# EAGLE design LED3 (EAGLE 9.6.0)
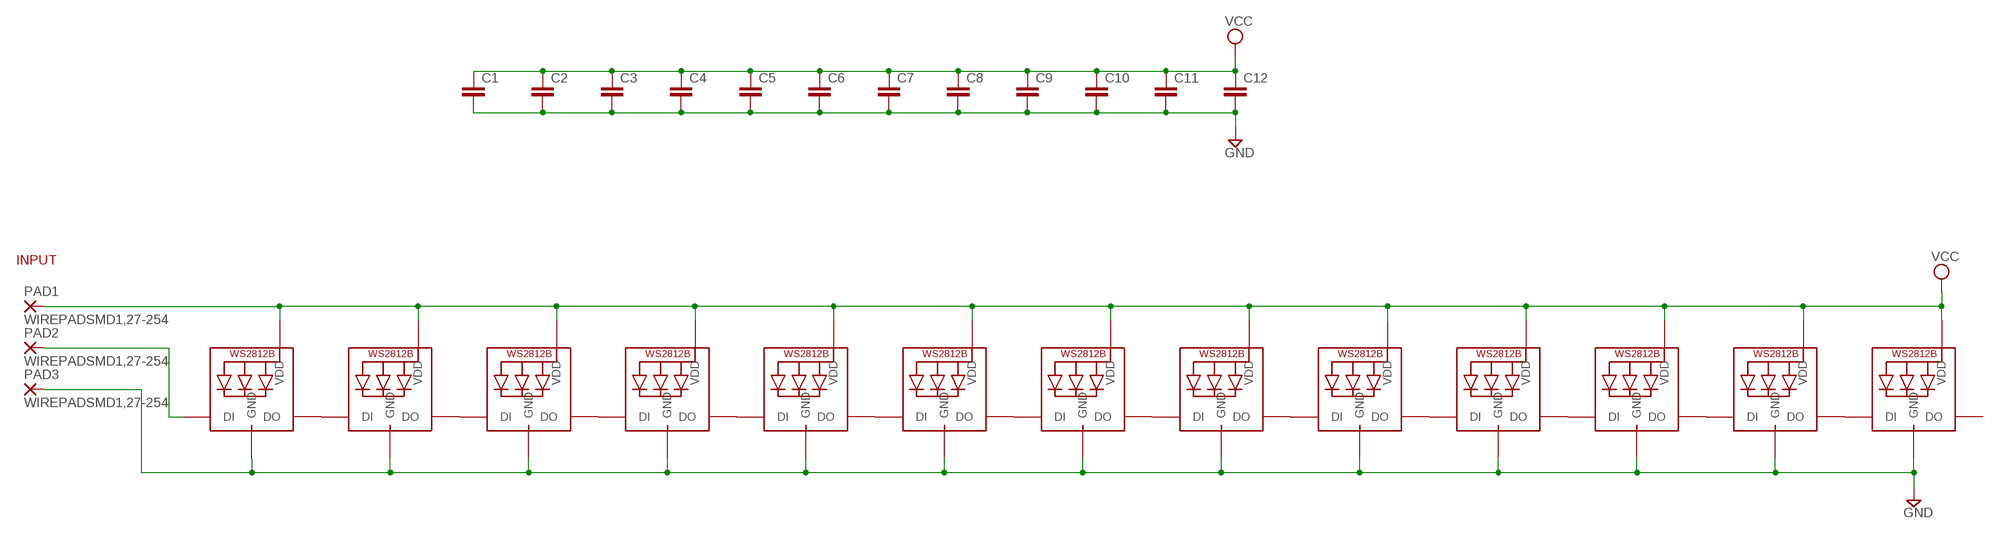
[diagram p0: schematic, sheet 1]

## Parts
C1  C-EUC0805K  [C0805K]
C2  C-EUC0805K  [C0805K]
C3  C-EUC0805K  [C0805K]
C4  C-EUC0805K  [C0805K]
C5  C-EUC0805K  [C0805K]
C6  C-EUC0805K  [C0805K]
C7  C-EUC0805K  [C0805K]
C8  C-EUC0805K  [C0805K]
C9  C-EUC0805K  [C0805K]
C10  C-EUC0805K  [C0805K]
C11  C-EUC0805K  [C0805K]
C12  C-EUC0805K  [C0805K]
LED1  WS2812B5050  [WS2812B]
LED2  WS2812B5050  [WS2812B]
LED3  WS2812B5050  [WS2812B]
LED4  WS2812B5050  [WS2812B]
LED5  WS2812B5050  [WS2812B]
LED6  WS2812B5050  [WS2812B]
LED7  WS2812B5050  [WS2812B]
LED8  WS2812B5050  [WS2812B]
LED9  WS2812B5050  [WS2812B]
LED10  WS2812B5050  [WS2812B]
LED11  WS2812B5050  [WS2812B]
LED12  WS2812B5050  [WS2812B]
LED13  WS2812B5050  [WS2812B]
PAD1  WIREPADSMD1,27-254  [SMD1,27-2,54]
PAD2  WIREPADSMD1,27-254  [SMD1,27-2,54]
PAD3  WIREPADSMD1,27-254  [SMD1,27-2,54]

## Nets
GND: C1.2 C2.2 C3.2 C4.2 C5.2 C6.2 C7.2 C8.2 C9.2 C10.2 C11.2 C12.2 LED1.3-GND(GND) LED2.3-GND(GND) LED3.3-GND(GND) LED4.3-GND(GND) LED5.3-GND(GND) LED6.3-GND(GND) LED7.3-GND(GND) LED8.3-GND(GND) LED9.3-GND(GND) LED10.3-GND(GND) LED11.3-GND(GND) LED12.3-GND(GND) LED13.3-GND(GND) PAD3.1(P)
N$1: LED1.2-DOUT(DO) LED2.4-DIN(DI)
N$2: LED2.2-DOUT(DO) LED3.4-DIN(DI)
N$3: LED3.2-DOUT(DO) LED4.4-DIN(DI)
N$4: LED4.2-DOUT(DO) LED5.4-DIN(DI)
N$5: LED5.2-DOUT(DO) LED6.4-DIN(DI)
N$6: LED6.2-DOUT(DO) LED7.4-DIN(DI)
N$7: LED8.2-DOUT(DO) LED9.4-DIN(DI)
N$8: LED9.2-DOUT(DO) LED10.4-DIN(DI)
N$9: LED10.2-DOUT(DO) LED11.4-DIN(DI)
N$10: LED11.2-DOUT(DO) LED12.4-DIN(DI)
N$11: LED12.2-DOUT(DO) LED13.4-DIN(DI)
N$12: LED7.2-DOUT(DO) LED8.4-DIN(DI)
N$14: LED1.4-DIN(DI) PAD2.1(P)
VCC: C1.1 C2.1 C3.1 C4.1 C5.1 C6.1 C7.1 C8.1 C9.1 C10.1 C11.1 C12.1 LED1.1-VDD(VDD) LED2.1-VDD(VDD) LED3.1-VDD(VDD) LED4.1-VDD(VDD) LED5.1-VDD(VDD) LED6.1-VDD(VDD) LED7.1-VDD(VDD) LED8.1-VDD(VDD) LED9.1-VDD(VDD) LED10.1-VDD(VDD) LED11.1-VDD(VDD) LED12.1-VDD(VDD) LED13.1-VDD(VDD) PAD1.1(P)
Unconnected: LED13.2-DOUT(DO)

## Notes on the sheet
- INPUT

## Library data of the parts
C1-C12 = rcl:C-EU: CAPACITOR, European symbol; SPICEPREFIX: C
LED1-LED13 = adafruit:WS2812B
PAD1-PAD3 = wirepad:WIREPAD: Wire PAD connect wire on PCB

## Board
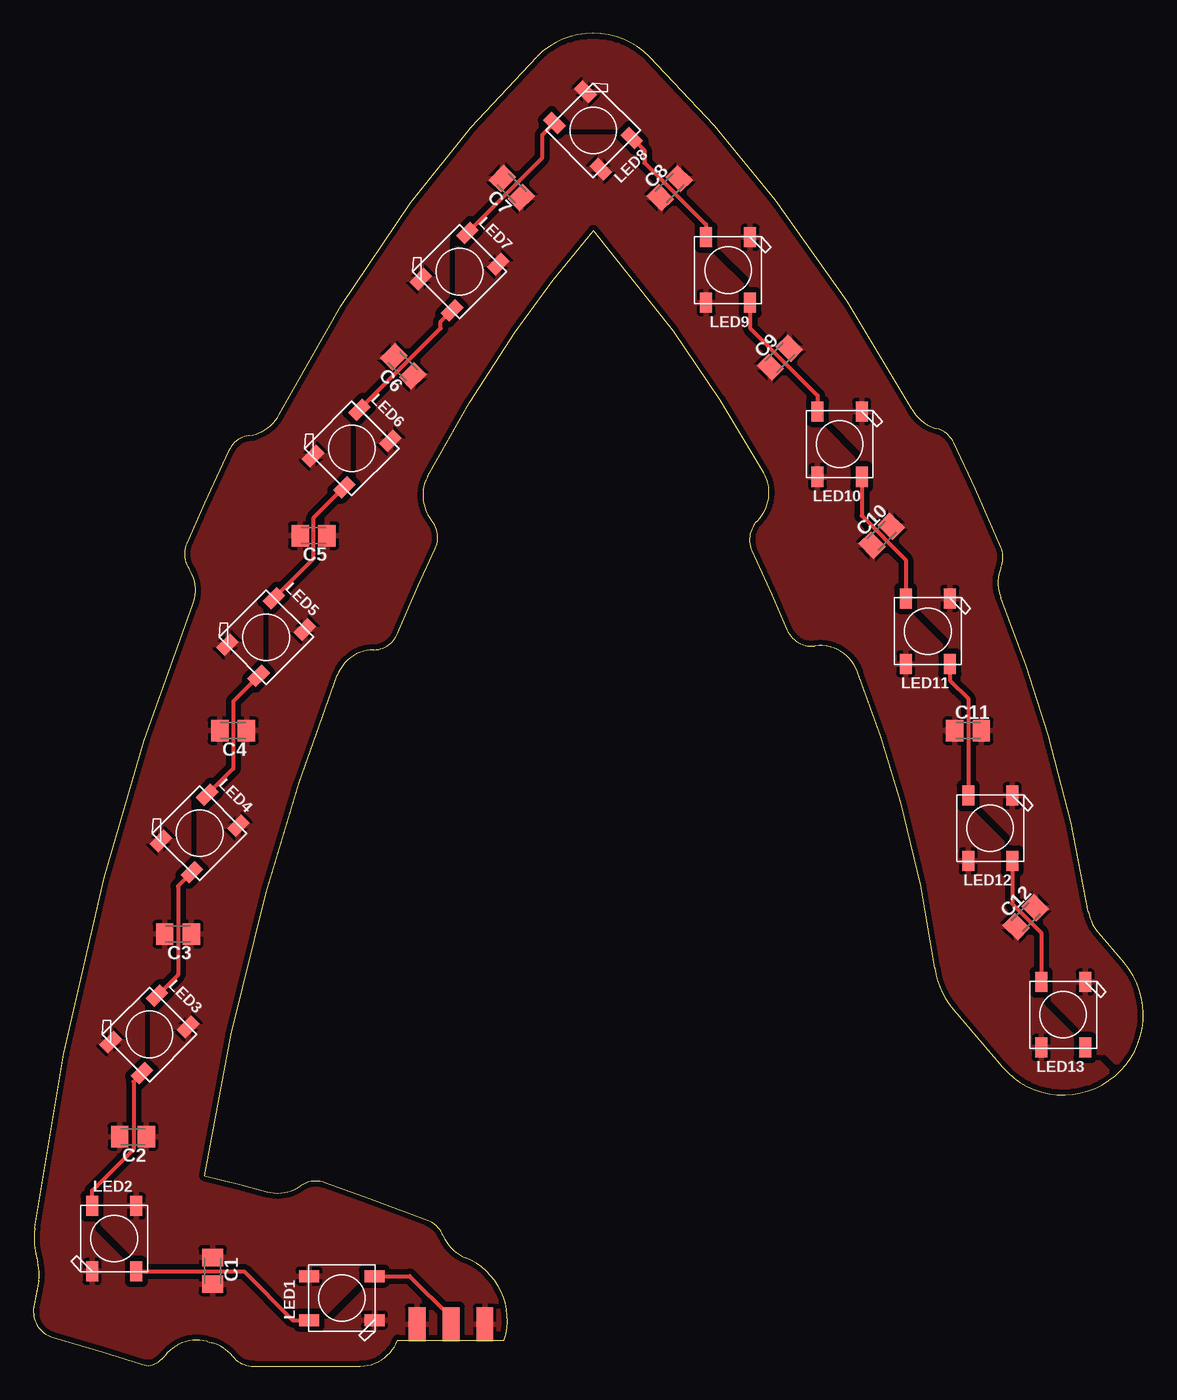
[diagram p1: board, top side]

Size 83.15 x 99.83 mm. Coordinates in mm from the lower left corner, seen from the top.
Outline: 27.29,1.94 35.27,1.94 arc86 32.37,8.12 arc-46 30.7,9.77 arc47 29.57,10.88 25.25,12.51 21.82,13.74 arc54 20.01,13.5 arc-50 17.5,13.07 15.44,13.62 12.83,14.26 14.83,24.85 17.43,35.45 19.9,43.68 22.76,51.74 arc-68 25.5,53.66 arc66 27.3,54.89 28.83,58.45 30.1,61.21 arc65 29.85,63.33 arc-67 29.52,66.64 32.67,72.18 36.07,77.44 38.93,81.36 41.95,85.06 47.95,77.53 51.47,72.34 54.73,66.91 arc-74 54.24,63.32 arc70 53.84,61.05 55.34,57.77 56.46,55.16 arc75 58.56,53.94 arc-76 61.74,52.05 63.49,47.15 64.99,42.24 66.49,36 67.52,29.85 arc33 68.91,26.73 72.59,22.42 arc180 81.71,30.21 79.73,32.54 arc-31 79.04,34.02 77.76,40.65 76.03,47.27 74.37,52.44 72.47,57.56 arc-44 72.49,59.82 arc45 72.49,61.36 70.56,65.75 68.94,69.18 arc49 67.66,70.24 arc-46 65.8,71.69 60.98,79.75 55.6,87.34 51.02,92.92 46.16,98.1 arc89 37.71,98.1 32.79,92.81 28.26,87.14 23.04,79.44 18.41,71.29 arc-55 16.17,69.71 arc56 14.64,68.59 12.83,64.7 11.49,61.62 arc56 11.66,59.75 arc-55 11.94,57.01 8.32,46.87 5.3,36.56 2.28,23.38 0.11,10.37 arc25 0.31,7.81 arc-27 0.39,6.4 0.03,4.45 arc84 1.44,2.17 5.15,1.07 8.15,0.14 arc9 8.62,0.03 arc42 9.86,0.78 arc-67 13,1.85 13.2,1.8 13.36,1.76 arc-36 14.92,0.74 arc51 16.48,0 24.48,0 arc69 27.29,1.94
Copper layers (1*16): Top 0.035559375mm / dielectric 1.6mm / Bottom 0.035559375mm
Design rules "jlcpcb2layer": minimum track width 5mil, minimum drill 8mil, track to track 5mil, track to pad 5mil, pad to pad 20mil, via to via 10mil, smd to smd 5mil, copper to edge 8mil, drill to drill 20mil, minimum pad ring 12mil, minimum via ring 5mil, stop-mask expansion 2.5mil, vias tented up to drill 20mil, thermal gap 10mil

### Footprints (pad centres in the part's own frame; a part is rotated, then mirrored left to right if it is on the bottom)
C0805K = smd 1.3 x 1.6: 1 -1,0; 2 1,0
WS2812B = smd 1.5 x 0.9: 1-VDD 2.45,-1.65; 2-DOUT 2.45,1.65; 3-GND -2.45,1.65; 4-DIN -2.45,-1.65
SMD1,27-2,54 = smd 1.27 x 2.54: 1 0,0

### Placement (x,y rotation side)
C1  13.43,7.15 270 top
C2  7.47,17.19 180 top
C3  10.84,32.36 180 top
C4  14.96,47.6 180 top
C5  21,62.2 180 top
C6  27.71,74.89 135 top
C7  35.84,88.25 135 top
C8  47.67,88.24 45 top
C9  55.92,75.54 45 top
C10  63.54,62.2 45 top
C11  70.02,47.6 0 top
C12  74.34,33.63 45 top
LED1  23.1,5.09 180 top
LED2  6.05,9.55 90 top
LED3  8.7,24.85 45 top
LED4  12.45,39.91 45 top
LED5  17.44,54.61 45 top
LED6  23.85,68.74 45 top
LED7  31.93,81.99 45 top
LED8  41.93,92.56 315 top
LED9  52.04,82.1 270 top
LED10  60.4,69.06 270 top
LED11  67.01,55.06 270 top
LED12  71.68,40.29 270 top
LED13  77.15,26.32 270 top
PAD1  33.82,3.15 0 top
PAD2  31.28,3.15 0 top
PAD3  28.74,3.15 0 top

### Tracks (layer width: path | path; a pad name or v marks a point on that pad's centre or on a via)
GND
  pour Top (isolate 0.406, rank 2): 1.44,2.17 arc-84 0.03,4.45 0.39,6.4 arc27 0.31,7.81 arc-25 0.11,10.37 2.28,23.38 5.3,36.56 8.32,46.87 11.94,57.01 arc55 11.66,59.75 arc-56 11.49,61.62 12.83,64.7 14.64,68.59 arc-56 16.17,69.71 arc55 18.41,71.29 23.04,79.44 28.26,87.14 32.79,92.81 37.71,98.1 arc-89 46.16,98.1 51.02,92.92 55.6,87.34 60.98,79.75 65.8,71.69 arc46 67.66,70.24 arc-49 68.94,69.18 70.56,65.75 72.49,61.36 arc-45 72.49,59.82 arc44 72.47,57.56 74.37,52.44 76.03,47.27 77.76,40.65 79.04,34.02 arc31 79.73,32.54 81.71,30.21 arc-180 72.59,22.42 68.91,26.73 arc-33 67.52,29.85 66.49,36 64.99,42.24 63.49,47.15 61.74,52.05 arc76 58.56,53.94 arc-75 56.46,55.16 55.34,57.77 53.84,61.05 arc-70 54.24,63.32 arc74 54.73,66.91 51.47,72.34 47.95,77.53 41.95,85.06 38.93,81.36 36.07,77.44 32.67,72.18 29.52,66.64 arc67 29.85,63.33 arc-65 30.1,61.21 28.83,58.45 27.3,54.89 arc-66 25.5,53.66 arc68 22.76,51.74 19.9,43.68 17.43,35.45 14.83,24.85 12.83,14.26 15.44,13.62 17.5,13.07 arc50 20.01,13.5 arc-54 21.82,13.74 25.25,12.51 29.57,10.88 arc-47 30.7,9.77 arc46 32.37,8.12 arc-86 35.27,1.94 27.29,1.94 arc-69 24.48,0 16.48,0 arc-51 14.92,0.74 arc36 13.36,1.76 13.2,1.8 13,1.85 arc67 9.86,0.78 arc-42 8.63,0.03 arc-9 8.15,0.14 5.15,1.07
N$1
  Top 0.305: LED2.4-DIN 12.5,7.1 15.78,7.1 19.43,3.44 LED1.2-DOUT
N$2
  Top 0.305: LED3.4-DIN 7.5,21.31 7.5,16.23 4.4,13.14 LED2.2-DOUT
N$3
  Top 0.305: LED4.4-DIN 10.84,35.96 10.84,29.32 LED3.2-DOUT
N$4
  Top 0.305: LED5.4-DIN 14.97,49.8 14.97,44.76 LED4.2-DOUT
N$5
  Top 0.305: LED5.2-DOUT 21,60.5 21,63.55 LED6.4-DIN
N$6
  Top 0.305: LED6.2-DOUT 30.52,77.74 30.52,78.24 LED7.4-DIN
N$7
  Top 0.305: LED8.2-DOUT 45.76,91.07 45.76,90.14 50.39,85.52 LED9.4-DIN
N$8
  Top 0.305: LED9.2-DOUT 53.69,77.77 58.75,72.71 LED10.4-DIN
N$9
  Top 0.305: LED10.2-DOUT 62.05,63.7 65.36,60.39 LED11.4-DIN
N$10
  Top 0.305: LED11.2-DOUT 68.66,51.37 70.03,50 LED12.4-DIN
N$11
  Top 0.305: LED12.2-DOUT 73.33,34.63 75.5,32.47 LED13.4-DIN
N$12
  Top 0.305: LED7.2-DOUT 38.14,90.53 38.14,92.24 LED8.4-DIN
N$14
  Top 0.305: LED1.4-DIN 28.2,6.74 31.28,3.66 PAD2.1
VCC
  pour Top (isolate 0.406): 31.16,1.88 31.16,3.78 28.17,6.77 24.62,6.77 21.31,3.47 19.41,3.47 15.79,7.09 7.73,7.09 7.66,7.15 7.66,8.23 4.49,11.4 4.49,13.31 7.66,16.48 7.66,21.56 8.93,22.83 8.93,27.28 10.84,29.18 10.84,36.17 12.42,37.76 12.42,42.33 14.96,44.87 14.96,49.76 17.82,52.62 17.82,57.12 21,60.3 21,63.47 24.36,66.84 24.36,71.54 30.52,77.7 30.52,78.08 31.79,79.35 31.79,84.11 38.14,90.46 38.14,92.05 44.81,92.05 45.76,91.1 45.76,90.08 50.4,85.45 50.4,83.6 53.7,80.3 53.7,77.76 58.46,73 58.46,70.9 62.08,67.28 62.08,63.67 65.45,60.3 65.45,56.49 68.62,53.31 68.62,51.41 69.89,50.14 69.89,41.88 73.32,38.46 73.32,34.65 75.48,32.49 75.48,27.03 81.42,21.09 62.21,1.88

### Text on the board
tTest: GND | DIN | 5V